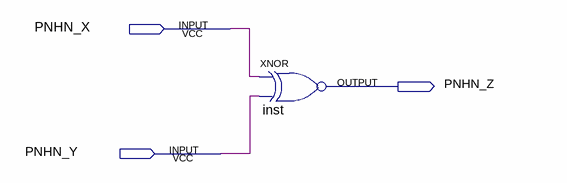
[diagram p0: schematic sheet]
// Quartus schematic Assignment7.bdf as structural Verilog: 1 symbols, 3 pins
module Assignment7 (
  input  PNHN_X,
  input  PNHN_Y,
  output PNHN_Z
);

  xnor inst (PNHN_Z, PNHN_X, PNHN_Y);
endmodule
